# Altium schematic sheet AUDIO_MIC.SchDoc
size A3
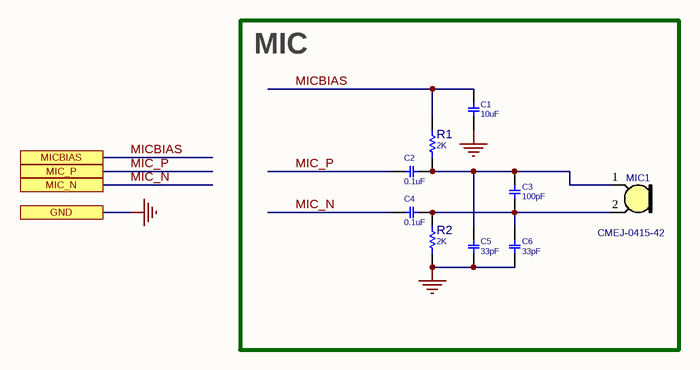
[diagram p0: AUDIO_MIC.SchDoc]

## Parts
C1  10uF  [C0402]
C2  0.1uF  [C0402]
C3  100pF  [C0402]
C4  0.1uF  [C0402]
C5  33pF  [C0402]
C6  33pF  [C0402]
MIC1  CMEJ-0415-42  [MIC_C4]
R1  2K  [R0402]
R2  2K  [R0402]

## Blocks framed on the sheet
MIC: C1-C6 MIC1 R1 R2

## Ports
GND, MIC_N, MIC_P, MICBIAS

## Nets
GND: C1.2 C5.1 C6.1 R2.1 ; port GND
MIC_N: C4.1 ; port MIC_N
MIC_P: C2.1 ; port MIC_P
MICBIAS: C1.1 R1.1 ; port MICBIAS
NetC2_2: C2.2 C3.2 C5.2 MIC1.1(OUT) R1.2
NetC3_1: C3.1 C4.2 C6.2 MIC1.2(GND) R2.2

## Library data of the parts
C1 = CAP_SMD_MLCC: CAP, MLCC; PARAM: X5R, 10%; MANF_P#: GRM155R60J106ME15; MANF: Murata; PARAM2: 6.3v; PRICE: 10,000: $0.034; ASSEMBLY: ASSEMBLY; VALUE: 10uF
C2 C4 = CAP_SMD_MLCC_100n50TDK: CAP, MLCC; PARAM: X7R, 10%, -55~125oC; MANF_P#: GRM155R71H104KE14D; MANF: Murata; PARAM2: 50v; ASSEMBLY: ASSEMBLY; PRICE: 100: 0.018$; VALUE: 0.1uF
C3 C5 C6 = CAP_SMD_MLCC_100n50TDK: CAP, MLCC, 100nF, 50V, X7R, 10%, 0402C; PARAM: X7R, 10%, -55~125oC; MANF_P#: GCM155R71H104KE02D; MANF: Murata; PARAM2: 50V; ASSEMBLY: ASSEMBLY; PRICE: 100= 1.3$
  C3: VALUE: 100pF
  C5 C6: VALUE: 33pF
MIC1 = MIC_CMEJ-0415-42: MICROPHONE, OMNI 4X1.5mm 2.2k -42DB; MANF: CUI; PARAM: -42dB sens, 60 dB SNR, THD 1%; MANF_P#: CMEJ-0415-42-P; PARAM2: 2.2k; PRICE: 0.4$; Value: CMEJ-0415-42
R1 R2 = RES_SMD: RESISTOR, SMD; PARAM: 0.063W; DESC: DESCRIPTION; DIST#: MOUSER; PARAM2: 1%; MANF_P#: -; MANF: -; ASSEMBLY: ASSEMBLY; PRICE: 100= 0.3$; VALUE: 2K